# Altium schematic sheet Power Supply.SchDoc
size A4; DrawnBy: Craig Comberbach; DocumentNumber: 6; Revision: A1; SheetNumber: 6; SheetTotal: 7
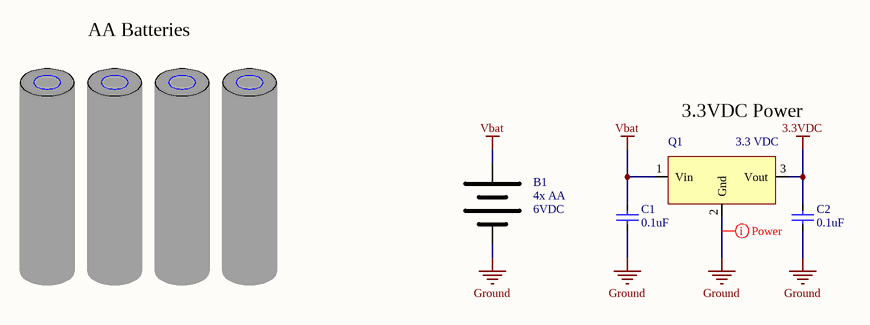
[diagram p0: Power Supply.SchDoc]

## Parts
B1  QuickValue: 4x AA  Voltage: 6VDC  (hidden comment: Battery)
B2  AA Battery  (value not drawn)
B3  AA Battery  (value not drawn)
B4  AA Battery  (value not drawn)
B5  AA Battery  (value not drawn)
C1  QuickValue: 0.1uF  [Capacitor - 0603]
C2  QuickValue: 0.1uF  [Capacitor - 0603]
Q1  QuickValue: 3.3 VDC  [SOT223-B - v2]  (hidden comment: Voltage Regulator, Fixed)

## Nets
3.3VDC: C2.1 Q1.3(Vout)
Ground: B1.2(Negative) C1.2 C2.2 Q1.2(Gnd)
Vbat: B1.1(Positive) C1.1 Q1.1(Vin)

## Layout directives
net class Power: Ground

## Notes on the sheet
- AA Batteries
- 3.3VDC Power

## Library data of the parts
B1 = Battery: Value: 4x AA Battery holder; Technology: THT; Supplier 1: Digi-Key; Supplier Part Number 1: SBH341AS-ND; Package: 4xAA
B2-B5 = AA Battery: Battery; Voltage: 1.5VDC; Value: AA Battery; QuickValue: AA Battery; Technology: THT; Supplier 1: Digi-Key; Supplier Part Number 1: P646-ND; Package: AA
C1 C2 = Capacitor (Non-polarized): Non-polarized; Value: 0.1uF 0603 10% 50V X7R; Notes: X7R; Tolerance: 10%; Voltage: 50V; Technology: THT; Supplier 1: Digi-Key; Supplier Part Number 1: 399-4491-1-ND; Package: Radial
Q1 = Voltage Regulator, Fixed: Value: 3.3 VDC fixed regulator; Technology: THT; Supplier 1: Digi-Key; Supplier Part Number 1: 497-7288-ND; Package: TO92-3